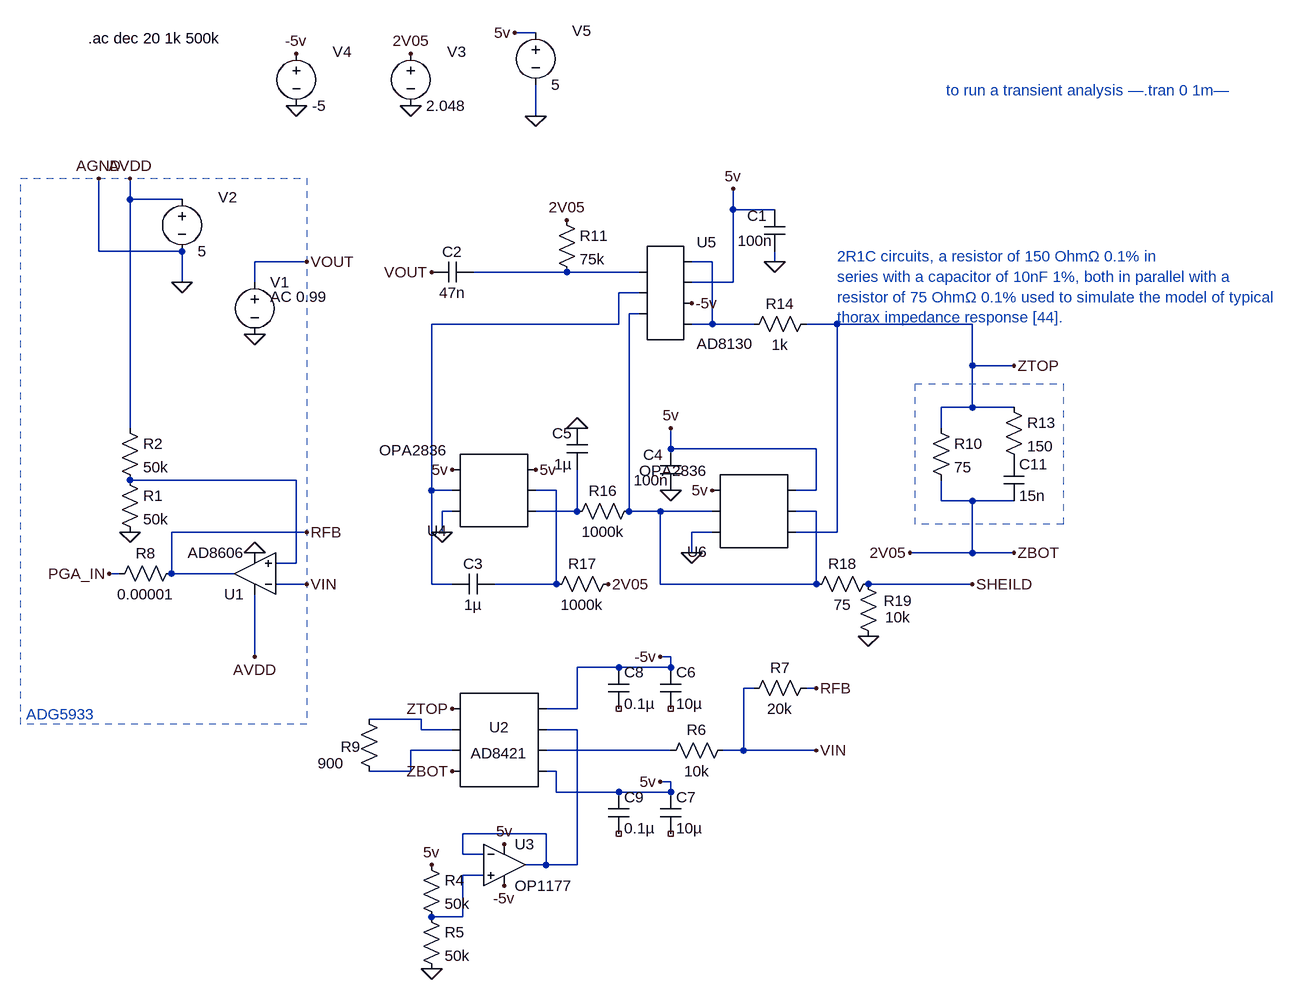
[diagram p0: schematic AD5933_model_AllisonRRC_adjusted.asc]
AD5933_model_AllisonRRC_adjusted.asc, the LTspice schematic file:
Version 4
SHEET 1 1812 1264
WIRE 272 -240 240 -240
WIRE 272 -112 272 -160
WIRE -352 16 -352 -16
WIRE -272 16 -352 16
WIRE 576 32 576 0
WIRE 640 32 576 32
WIRE -400 96 -400 -16
WIRE -272 96 -400 96
WIRE -80 112 -160 112
WIRE 544 112 512 112
WIRE 640 112 640 96
WIRE 320 128 176 128
WIRE 432 128 320 128
WIRE -272 144 -272 96
WIRE -160 144 -160 112
WIRE 576 144 576 32
WIRE 576 144 512 144
WIRE 432 160 400 160
WIRE 432 192 416 192
WIRE 400 208 400 160
WIRE 400 208 112 208
WIRE 544 208 544 112
WIRE 544 208 512 208
WIRE 608 208 544 208
WIRE 736 208 688 208
WIRE 944 208 736 208
WIRE 944 272 944 208
WIRE 1008 272 944 272
WIRE 944 336 944 272
WIRE 944 336 896 336
WIRE 1008 336 944 336
WIRE -352 368 -352 16
WIRE 896 368 896 336
WIRE 480 400 480 368
WIRE 704 400 480 400
WIRE -96 448 -352 448
WIRE 112 464 112 208
WIRE 144 464 112 464
WIRE 304 464 272 464
WIRE 704 464 704 400
WIRE 704 464 672 464
WIRE 896 480 896 448
WIRE 944 480 896 480
WIRE 1008 480 944 480
WIRE 144 496 128 496
WIRE 336 496 336 432
WIRE 336 496 272 496
WIRE 416 496 416 192
WIRE 464 496 416 496
WIRE 544 496 464 496
WIRE 704 496 672 496
WIRE -80 528 -288 528
WIRE 128 528 128 496
WIRE 544 528 512 528
WIRE 736 528 736 208
WIRE 736 528 672 528
WIRE 512 560 512 528
WIRE 944 560 944 480
WIRE 944 560 848 560
WIRE 1008 560 944 560
WIRE -96 576 -96 448
WIRE -96 576 -128 576
WIRE -368 592 -384 592
WIRE -288 592 -288 528
WIRE -192 592 -288 592
WIRE -80 608 -128 608
WIRE 112 608 112 464
WIRE 144 608 112 608
WIRE 304 608 304 464
WIRE 304 608 208 608
WIRE 464 608 464 496
WIRE 704 608 704 496
WIRE 704 608 464 608
WIRE 944 608 784 608
WIRE -160 720 -160 624
WIRE 480 720 464 720
WIRE 400 736 336 736
WIRE 480 736 480 720
WIRE 480 736 400 736
WIRE 608 768 592 768
WIRE 704 768 688 768
WIRE 336 800 336 736
WIRE 336 800 288 800
WIRE 96 816 16 816
WIRE 96 832 96 816
WIRE 144 832 96 832
WIRE 336 832 288 832
WIRE 144 864 80 864
WIRE 480 864 288 864
WIRE 592 864 592 768
WIRE 592 864 560 864
WIRE 704 864 592 864
WIRE 80 896 80 864
WIRE 80 896 16 896
WIRE 304 896 288 896
WIRE 480 912 464 912
WIRE 304 928 304 896
WIRE 400 928 304 928
WIRE 480 928 480 912
WIRE 480 928 400 928
WIRE 288 992 160 992
WIRE 160 1024 160 992
WIRE 192 1024 160 1024
WIRE 288 1040 288 992
WIRE 288 1040 256 1040
WIRE 336 1040 336 832
WIRE 336 1040 288 1040
WIRE 192 1056 160 1056
WIRE 160 1120 160 1056
WIRE 160 1120 112 1120
FLAG -272 144 0
FLAG -160 224 0
FLAG -80 112 VOUT
FLAG -352 -16 AVDD
FLAG -400 -16 AGND
FLAG 112 128 VOUT
FLAG 336 368 0
FLAG 480 464 0
FLAG 784 688 0
FLAG 144 432 5v
FLAG 480 368 5v
FLAG 544 464 5v
FLAG 512 560 0
FLAG 128 528 0
FLAG 272 432 5v
FLAG 576 0 5v
FLAG 640 112 0
FLAG 80 -128 0
FLAG 80 -208 2V05
FLAG -96 -128 0
FLAG -96 -208 -5v
FLAG 512 176 -5v
FLAG 320 48 2V05
FLAG 384 608 2V05
FLAG -160 560 0
FLAG -352 528 0
FLAG -384 592 PGA_IN
FLAG -80 608 VIN
FLAG -80 528 RFB
FLAG 1008 272 ZTOP
FLAG 1008 560 ZBOT
FLAG 144 896 ZBOT
FLAG 144 800 ZTOP
FLAG 112 1200 0
FLAG 112 1040 5v
FLAG 224 1072 -5v
FLAG 224 1008 5v
FLAG 704 768 RFB
FLAG 704 864 VIN
FLAG 464 912 5v
FLAG 464 720 -5v
FLAG 240 -240 5v
FLAG 272 -112 0
FLAG -160 720 AVDD
FLAG 848 560 2V05
FLAG 944 608 SHEILD
SYMBOL voltage -160 128 R0
WINDOW 3 24 38 Invisible 2
WINDOW 123 24 38 Left 2
SYMATTR Value SINE(1.48 0.99 1k)
SYMATTR Value2 AC 0.99
SYMATTR InstName V1
SYMBOL voltage -272 0 R0
WINDOW 0 56 13 Left 2
SYMATTR InstName V2
SYMATTR Value 5
SYMBOL AutoGenerated/OPA2836 208 464 R180
SYMATTR InstName U4
SYMBOL AutoGenerated/AD8130 464 160 R0
SYMATTR InstName U5
SYMBOL AutoGenerated/OPA2836 608 496 R180
SYMATTR InstName U6
SYMBOL cap 176 112 R90
WINDOW 0 0 32 VBottom 2
WINDOW 3 32 32 VTop 2
SYMATTR InstName C2
SYMATTR Value 47n
SYMBOL res 304 32 R0
SYMATTR InstName R11
SYMATTR Value 75k
SYMBOL res 704 192 R90
WINDOW 0 0 56 VBottom 2
WINDOW 3 32 56 VTop 2
SYMATTR InstName R14
SYMATTR Value 1k
SYMBOL res 432 480 R90
WINDOW 0 0 56 VBottom 2
WINDOW 3 32 56 VTop 2
SYMATTR InstName R16
SYMATTR Value 1000k
SYMBOL res 400 592 R90
WINDOW 0 0 56 VBottom 2
WINDOW 3 32 56 VTop 2
SYMATTR InstName R17
SYMATTR Value 1000k
SYMBOL res 800 592 R90
WINDOW 0 0 56 VBottom 2
WINDOW 3 32 56 VTop 2
SYMATTR InstName R18
SYMATTR Value 75
SYMBOL res 800 704 R180
WINDOW 0 -52 70 Left 2
WINDOW 3 -49 45 Left 2
SYMATTR InstName R19
SYMATTR Value 10k
SYMBOL cap 208 592 R90
WINDOW 0 0 32 VBottom 2
WINDOW 3 32 32 VTop 2
SYMATTR InstName C3
SYMATTR Value 1µ
SYMBOL cap 496 464 R180
WINDOW 0 28 55 Left 2
WINDOW 3 19 16 Left 2
SYMATTR InstName C4
SYMATTR Value 100n
SYMBOL cap 352 432 R180
WINDOW 0 24 56 Left 2
WINDOW 3 24 8 Left 2
SYMATTR InstName C5
SYMATTR Value 1µ
SYMBOL cap 656 96 R180
WINDOW 0 28 55 Left 2
WINDOW 3 19 16 Left 2
SYMATTR InstName C1
SYMATTR Value 100n
SYMBOL voltage 80 -224 R0
WINDOW 0 56 13 Left 2
SYMATTR InstName V3
SYMATTR Value 2.048
SYMBOL voltage -96 -224 R0
WINDOW 0 56 13 Left 2
SYMATTR InstName V4
SYMATTR Value -5
SYMBOL Opamps/AD8606 -160 656 R180
SYMATTR InstName U1
SYMBOL res -368 432 R0
SYMATTR InstName R1
SYMATTR Value 50k
SYMBOL res -368 352 R0
SYMATTR InstName R2
SYMATTR Value 50k
SYMBOL AutoGenerated/AD8421 208 848 R0
SYMATTR InstName U2
SYMBOL Opamps/OP1177 224 976 R0
SYMATTR InstName U3
SYMBOL res 96 1024 R0
SYMATTR InstName R4
SYMATTR Value 50k
SYMBOL res 96 1104 R0
SYMATTR InstName R5
SYMATTR Value 50k
SYMBOL cap 464 736 R0
SYMATTR InstName C6
SYMATTR Value 10µ
SYMBOL cap 464 928 R0
SYMATTR InstName C7
SYMATTR Value 10µ
SYMBOL cap 384 736 R0
SYMATTR InstName C8
SYMATTR Value 0.1µ
SYMBOL cap 384 928 R0
SYMATTR InstName C9
SYMATTR Value 0.1µ
SYMBOL res 704 752 R90
WINDOW 0 0 56 VBottom 2
WINDOW 3 32 56 VTop 2
SYMATTR InstName R7
SYMATTR Value 20k
SYMBOL res 576 848 R90
WINDOW 0 0 56 VBottom 2
WINDOW 3 32 56 VTop 2
SYMATTR InstName R6
SYMATTR Value 10k
SYMBOL voltage 272 -256 R0
WINDOW 0 56 13 Left 2
SYMATTR InstName V5
SYMATTR Value 5
SYMBOL res -272 576 R90
WINDOW 0 0 56 VBottom 2
WINDOW 3 32 56 VTop 2
SYMATTR InstName R8
SYMATTR Value 0.00001
SYMBOL res 0 800 R0
WINDOW 0 -28 58 Left 2
WINDOW 3 -63 84 Left 2
SYMATTR InstName R9
SYMATTR Value 900
SYMBOL cap 992 416 R0
SYMATTR InstName C11
SYMATTR Value 15n
SYMBOL res 880 352 R0
SYMATTR InstName R10
SYMATTR Value 75
SYMBOL res 992 320 R0
SYMATTR InstName R13
SYMATTR Value 150
TEXT -512 808 Left 2 ;ADG5933
TEXT 736 104 Left 2 ;2R1C circuits, a resistor of 150 OhmΩ 0.1% in\nseries with a capacitor of 10nF 1%, both in parallel with a\nresistor of 75 OhmΩ 0.1% used to simulate the model of typical\nthorax impedance response [44].
TEXT 904 -152 Left 2 ;to run a transient analysis —.tran 0 1m—
TEXT -416 -232 Left 2 !.ac dec 20 1k 500k
RECTANGLE Normal -520 -16 -80 824 2
RECTANGLE Normal 856 300 1084 516 2

The netlist it stands for:
* AD5933_model_AllisonRRC_adjusted.asc
V1 VOUT 0 SINE(1.48 0.99 1k) AC 0.99
V2 AVDD 0 5
* U4: OPA2836 (symbol AutoGenerated/OPA2836 not available, pins judged from their places): pin1=N007 pin2=N006 pin3=5v pin4=0 pin5=N003 pin6=5v
* U5: AD8130 (symbol AutoGenerated/AD8130 not available, pins judged from their places): pin1=N002 pin2=N003 pin3=N004 pin4=N001 pin5=5v pin6=-5v pin7=N001
* U6: OPA2836 (symbol AutoGenerated/OPA2836 not available, pins judged from their places): pin1=ZTOP pin2=N004 pin3=5v pin4=0 pin5=N004 pin6=5v
C2 N002 VOUT 47n
R11 ZBOT N002 75k
R14 ZTOP N001 1k
R16 N004 N007 1000k
R17 ZBOT N006 1000k
R18 SHEILD N004 75
R19 0 SHEILD 10k
C3 N006 N003 1µ
C4 0 5v 100n
C5 N007 0 1µ
C1 0 5v 100n
V3 ZBOT 0 2.048
V4 -5v 0 -5
XU1 N005 VIN AVDD 0 RFB AD8606  ; pins In+ In- V+ V- OUT
R1 N005 0 50k
R2 AVDD N005 50k
* U2: AD8421 (symbol AutoGenerated/AD8421 not available, pins judged from their places): pin1=ZTOP pin2=N008 pin3=N010 pin4=ZBOT pin5=-5v pin6=N009 pin7=N011 pin8=5v
XU3 N012 N009 5v -5v N009 OP1177  ; pins In+ In- V+ V- OUT
R4 5v N012 50k
R5 N012 0 50k
C6 -5v NC_01 10µ
C7 5v NC_02 10µ
C8 -5v NC_03 0.1µ
C9 5v NC_04 0.1µ
R7 RFB VIN 20k
R6 VIN N011 10k
V5 5v 0 5
R8 RFB PGA_IN 0.00001
R9 N008 N010 900
C11 P001 ZBOT 15n
R10 ZTOP ZBOT 75
R13 ZTOP P001 150
* ADG5933
* 2R1C circuits, a resistor of 150 OhmΩ 0.1% in
* series with a capacitor of 10nF 1%, both in parallel with a
* resistor of 75 OhmΩ 0.1% used to simulate the model of typical
* thorax impedance response [44].
* to run a transient analysis —.tran 0 1m—
.ac dec 20 1k 500k
.lib ADI.lib
.lib ADI1.lib
.backanno
.end